# EAGLE design SIPM_readout (EAGLE 9.6.2)
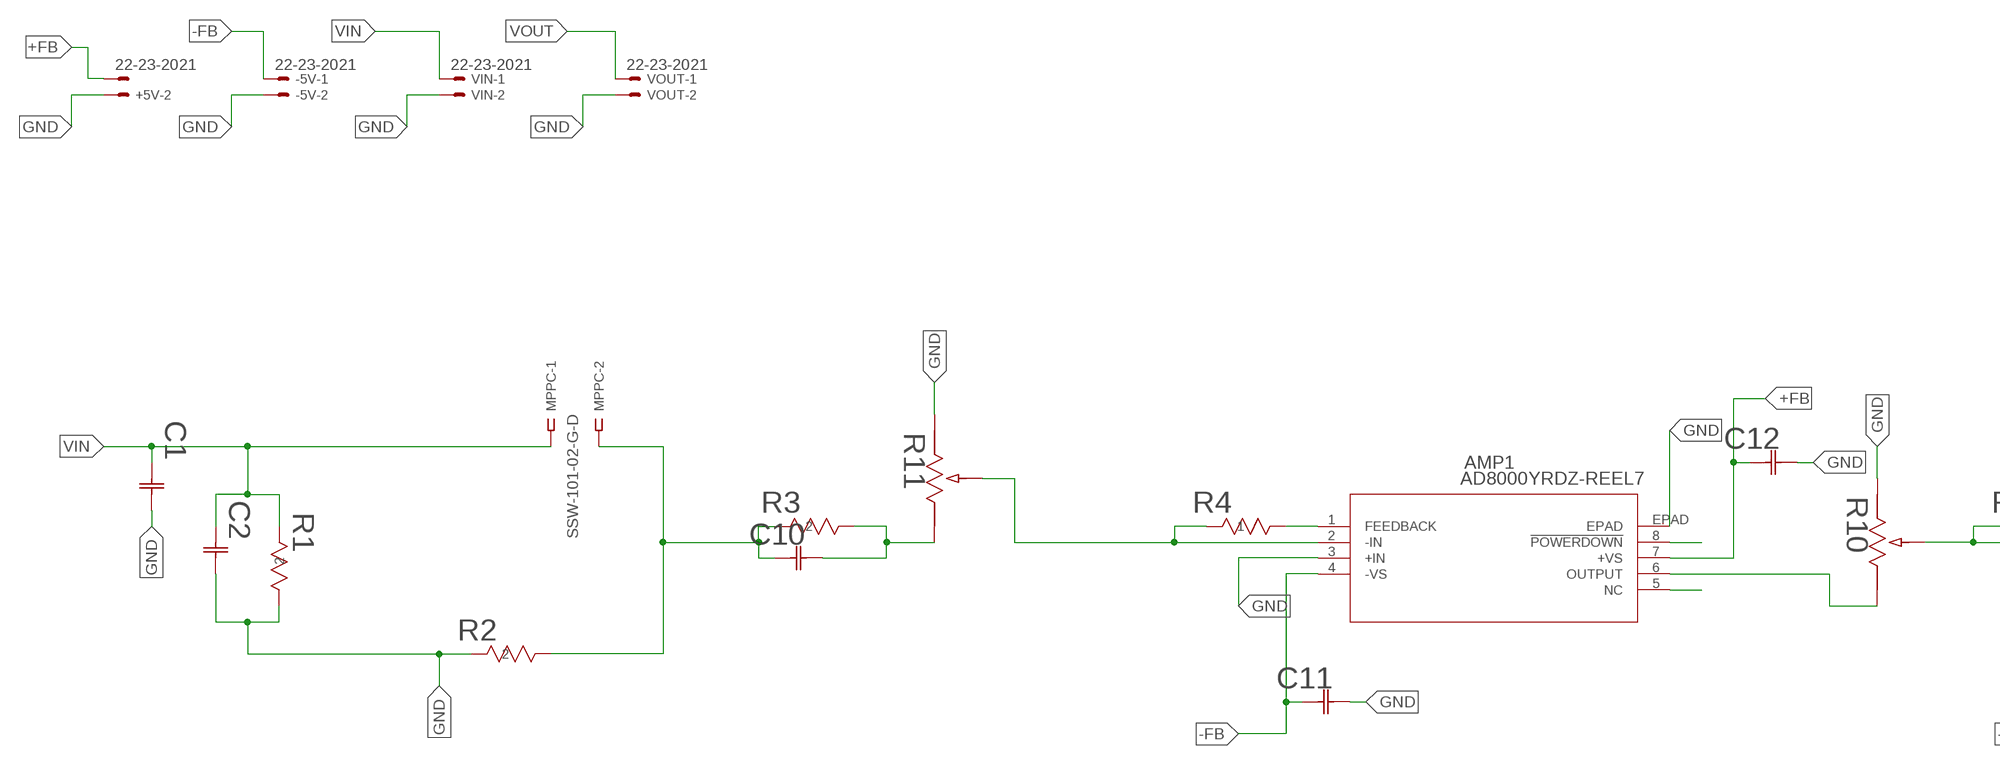
[diagram p0: schematic, sheet 1, part 1 of 2]
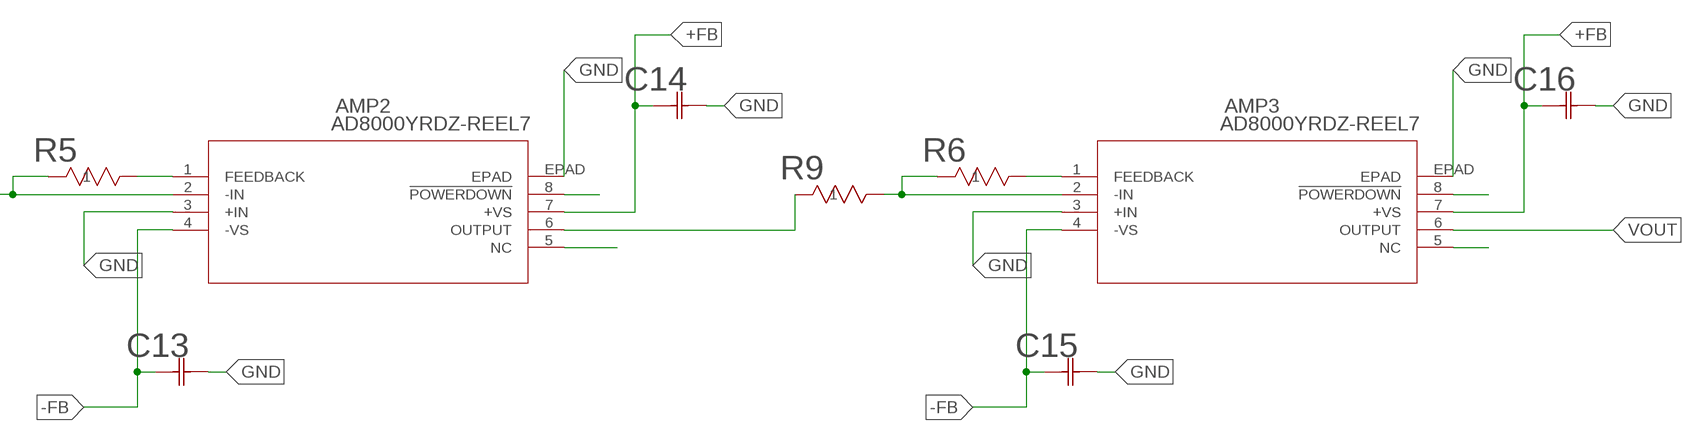
[diagram p1: schematic, sheet 1, part 2 of 2]

## Parts
+5V  22-23-2021  [22-23-2021]
-5V  22-23-2021  [22-23-2021]
AMP1  AD8000YRDZ-REEL7  [RD_8_1_ADI]
AMP2  AD8000YRDZ-REEL7  [RD_8_1_ADI]
AMP3  AD8000YRDZ-REEL7  [RD_8_1_ADI]
C1  C3225X7S2A335M200ABCAP_3225_TDK-M  [CAP_3225_TDK-M]
C2  C3225X7R2A105K200AACAP_3225_TDK-M  [CAP_3225_TDK-M]
C10  CGA3E2C0G1H101J080AA  [CAP_1608_TDK]
C11  CL10B104KB8NNNL  [CAP_CL10_SAM]
C12  CL10B104KB8NNNL  [CAP_CL10_SAM]
C13  CL10B104KB8NNNL  [CAP_CL10_SAM]
C14  CL10B104KB8NNNL  [CAP_CL10_SAM]
C15  CL10B104KB8NNNL  [CAP_CL10_SAM]
C16  CL10B104KB8NNNL  [CAP_CL10_SAM]
MPPC  SSW-101-02-G-D  [SSW-101-02-G-D]
R1  RC0603FR-072ML  [RC0603N_YAG]
R2  RT0603BRD0710RL  [RC0603N_YAG]
R3  RT0603BRD0710RL  [RC0603N_YAG]
R4  ESR03EZPF1001  [RES_R0603_ROM]
R5  ESR03EZPF1001  [RES_R0603_ROM]
R6  ESR03EZPF1001  [RES_R0603_ROM]
R9  ESR03EZPF1001  [RES_R0603_ROM]
R10  3214W-1-103E  [POT_3214W]
R11  3214W-1-103E  [POT_3214W]
VIN  22-23-2021  [22-23-2021]
VOUT  22-23-2021  [22-23-2021]

## Nets
+FB: +5V.1 AMP1.7(+VS) AMP2.7(+VS) AMP3.7(+VS) C12.1 C14.1 C16.1
-FB: -5V.1 AMP1.4(-VS) AMP2.4(-VS) AMP3.4(-VS) C11.1 C13.1 C15.1
GND: +5V.2 -5V.2 AMP1.3(+IN) AMP1.EPAD AMP2.3(+IN) AMP2.EPAD AMP3.3(+IN) AMP3.EPAD C1.2 C2.2 C11.2 C12.2 C13.2 C14.2 C15.2 C16.2 R1.1 R2.2 R10.1 R11.1 VIN.2 VOUT.2
N$1: AMP1.6(OUTPUT) R10.3
N$2: C10.1 MPPC.2 R2.1 R3.2
N$3: C10.2 R3.1 R11.3
N$4: AMP1.2(-IN) R4.1 R11.2
N$5: AMP1.5(NC)
N$6: AMP1.8(!POWERDOWN)
N$7: AMP1.1(FEEDBACK) R4.2
N$9: AMP2.8(!POWERDOWN)
N$10: AMP2.5(NC)
N$11: AMP2.1(FEEDBACK) R5.2
N$12: AMP2.2(-IN) R5.1 R10.2
N$14: AMP3.8(!POWERDOWN)
N$15: AMP3.5(NC)
N$16: AMP3.1(FEEDBACK) R6.2
N$17: AMP3.2(-IN) R6.1 R9.2
N$18: AMP2.6(OUTPUT) R9.1
VIN: C1.1 C2.1 MPPC.1 R1.2 VIN.1
VOUT: AMP3.6(OUTPUT) VOUT.1

## Library data of the parts
+5V -5V VIN VOUT = con-molex:22-23-2021: .100" (2.54mm) Center Header - 2 Pin; MF: MOLEX; MPN: 22-23-2021; OC_FARNELL: 1462926; OC_NEWARK: 25C3832
AMP1-AMP3 = SiPM_AD8000:AD8000YRDZ-REEL7; BUILT_BY: EMA_Jessica; COPYRIGHT: Copyright (C) 2018 Accelerated Designs. All rights reserved; MANUFACTURER_PART_NUMBER: AD8000YRDZ-REEL7; SOURCELIBRARY: Analog_2019-03-01; VENDOR: Analog Devices Inc
C1 = SiPM_3.3uF:C3225X7S2A335M200AB; BUILT_BY: EMA_UL_Team; MANUFACTURER_PART_NUMBER: C3225X7S2A335M200AB; SOURCELIBRARY: TDK_2015_05_22; VENDOR: TDK
C2 = SiPM_1uF:C3225X7R2A105K200AA; BUILT_BY: EMA_UL_Team; MANUFACTURER_PART_NUMBER: C3225X7R2A105K200AA; SOURCELIBRARY: TDK_2015_05_22; VENDOR: TDK
C10 = SiPM_100p:CGA3E2C0G1H101J080AA; BUILT_BY: EMA_UL_Team; MANUFACTURER_PART_NUMBER: CGA3E2C0G1H101J080AA; SOURCELIBRARY: TDK_2015_05_22; VENDOR: TDK
C11-C16 = SiPM_01u:CL10B104KB8NNNL; BUILT_BY: EMA_Rocco; COPYRIGHT: Copyright (C) 2018 Accelerated Designs. All rights reserved; MANUFACTURER_PART_NUMBER: CL10B104KB8NNNL; SOURCELIBRARY: Samsung_2019-08-29; VENDOR: Samsung
MPPC = con-samtec:SSW-101-02-G: THROUGH-HOLE .025" SQ POST SOCKET Source: Samtec SSW.pdf; MF: Samtec Inc.; MPN: SSW-101-02-G-D; OC_FARNELL: unknown; OC_NEWARK: 82P1456
R1 = SiPM_R6:RC0603FR-072ML; BUILT_BY: EMA_UL_Team; MANUFACTURER_PART_NUMBER: RC0603FR-072ML; SOURCELIBRARY: Yageo_2008-01-01_ChipRes1a; VENDOR: Yageo
R2 R3 = SiPM_R7:RT0603BRD0710RL; BUILT_BY: EMA_UL_Team; MANUFACTURER_PART_NUMBER: RT0603BRD0710RL; SOURCELIBRARY: Yageo_2008-01-01_ChipRes2b; VENDOR: Yageo
R4-R6 R9 = SiPM_R11:ESR03EZPF1001; BUILT_BY: EMA_UL_Team; MANUFACTURER_PART_NUMBER: ESR03EZPF1001; SOURCELIBRARY: Rohm_2015_05_27; VENDOR: ROHM Semiconductor
R10 R11 = SiPM_trim:3214W-1-103E; BUILT_BY: EMA_UL_Team; MANUFACTURER_PART_NUMBER: 3214W-1-103E; SOURCELIBRARY: Bourns_2012-08-08; VENDOR: Bourns Electronics

## Board
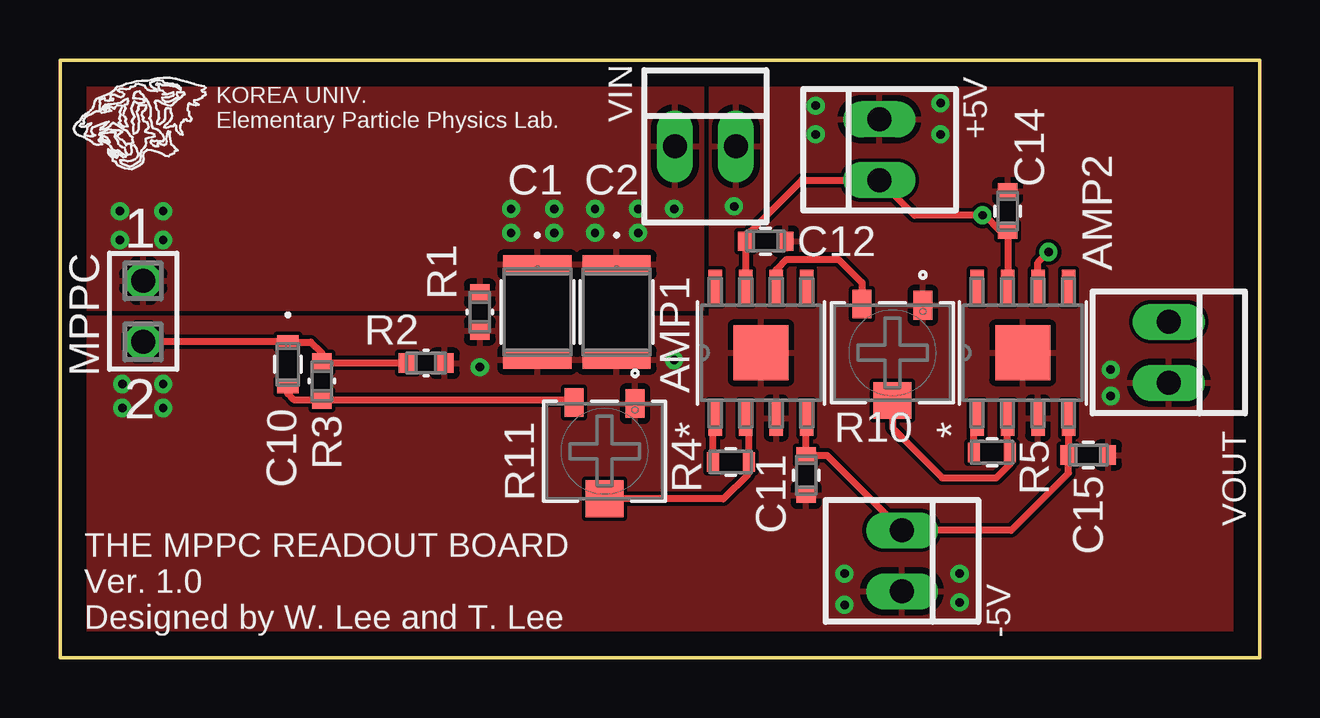
[diagram p2: board, top side]
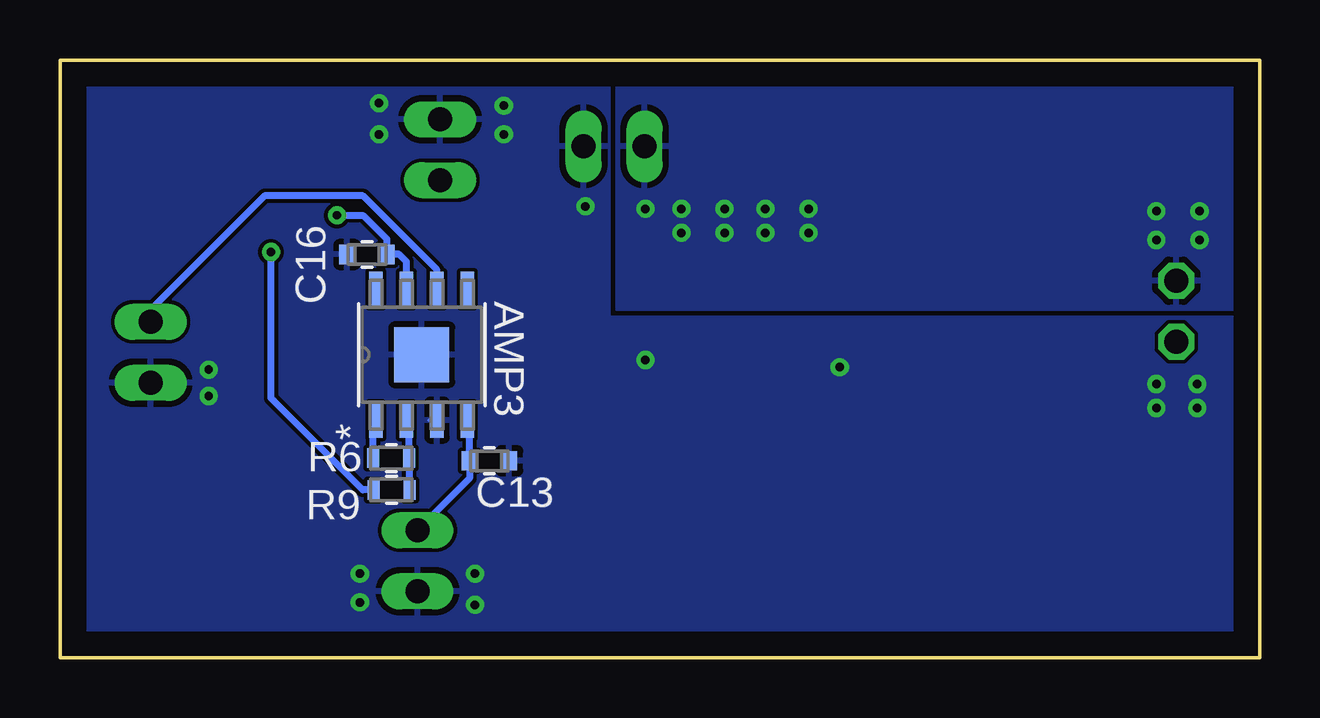
[diagram p3: board, bottom side, seen from below]

Size 50 x 24.9 mm. Coordinates in mm from the lower left corner, seen from the top.
Outline: 50,0 0,0 0,24.9 50,24.9 50,0
Copper layers (1*16): Top 0.035mm / dielectric 1.5mm / Bottom 0.035mm
Design rules "default": minimum track width 6mil, minimum drill 0.35mm, track to track 6mil, track to pad 6mil, pad to pad 6mil, via to via 6mil, smd to smd 6mil, copper to edge 40mil, drill to drill 6mil, minimum pad ring 10mil, minimum via ring 8mil, stop-mask expansion 4mil, vias tented up to drill 0mil, thermal gap 10mil

### Footprints (pad centres in the part's own frame; a part is rotated, then mirrored left to right if it is on the bottom)
22-23-2021 = drill 1 long: 1 -1.27,0; 2 1.27,0
RD_8_1_ADI = smd 1.46 x 0.559: 1 -2.724,1.905; 2 -2.724,0.635; 3 -2.724,-0.635; 4 -2.724,-1.905; 5 2.724,-1.905; 6 2.724,-0.635; 7 2.724,0.635; 8 2.724,1.905 | smd 2.286 x 2.286: EPAD 0,0
CAP_3225_TDK-M = smd 0.762 x 2.845: 1 -1.981,0; 2 1.981,0
CAP_1608_TDK = smd 0.559 x 0.889: 1 -0.927,0; 2 0.927,0
CAP_CL10_SAM = smd 0.656 x 0.8: 1 -0.828,0; 2 0.828,0
SSW-101-02-G-D = drill 1 pad 1.5 octagon: 1 0,-1.27; 2 0,1.27
RC0603N_YAG = smd 0.762 x 0.813: 1 -0.775,0; 2 0.775,0
RES_R0603_ROM = smd 0.5 x 0.813: 1 -0.75,0; 2 0.75,0
POT_3214W = smd 0.787 x 1.194: 1 -1.27,-1.981; 3 1.27,-2.032 | smd 1.575 x 1.524: 2 0,1.981

### Placement (x,y rotation side)
+5V  34.16,21.16 90 top
-5V  35.1,4.03 270 top
AMP1  29.22,12.7 90 top
AMP2  40.13,12.7 90 top
AMP3  34.92,12.62 90 bottom
C1  19.9,14.4 270 top
C2  23.2,14.4 270 top
C10  9.5,12.22 270 top
C11  31.1,7.6 270 top
C12  29.41,17.35 0 top
C13  32.1,8.2 0 bottom
C14  39.5,18.6 90 top
C15  42.86,8.44 0 top
C16  37.2,16.8 180 bottom
MPPC  3.47,14.43 180 top
R1  17.5,14.4 90 top
R2  15.26,12.27 0 top
R3  10.91,11.52 90 top
R4  27.96,8.15 180 top
R5  38.85,8.55 180 top
R6  36.19,8.31 180 bottom
R9  36.18,6.99 0 bottom
R10  34.7,12.7 180 top
R11  22.7,8.6 180 top
VIN  26.9,21.3 0 top
VOUT  46.22,12.72 270 top

### Tracks (layer width: path | path; a pad name or v marks a point on that pad's centre or on a via)
+FB  (via drill 0.35)
  Top 0.152: AMP1.7 28.6,15.44 | C14.1
  Top 0.3: AMP1.7 C12.1 28.8,17.57 28.8,17.77 30.92,19.89 +5V.1 35.62,18.43 v38.45,18.43 38.55,18.43 39.21,17.77 C14.1 AMP2.7
  Top 0.5: AMP1.7 28.57,15.44
  Bottom 0.3: AMP3.7 35.55,16.5 35.86,16.8 C16.1 36.37,17.43 37.37,18.43 v38.45,18.43
-FB
  Top 0.3: C11.1 31.1,9.95 AMP1.4 | AMP2.4 C15.1 | C15.1 | C11.1 31.3,8.43 | C11.1 31.97,8.43 -5V.1 39.65,5.3 42.03,7.68 C15.1
  Bottom 0.152: 33.02,8.29 C13.1
  Bottom 0.3: AMP3.4 32.93,9.81 C13.1 32.93,7.47 -5V.1
GND  (via drill 0.35)
  Bottom 0.152: 34.62,9.9 AMP3.3
  other vias: 2.6,11.4 4.3,11.4 2.6,10.4 4.3,10.4 25.6,12.4 17.5,12.1 43.8,12 43.8,10.9 37.5,3.5 37.5,2.3 32.7,3.5 32.7,2.2 31.5,23 31.5,21.8 36.7,23.1 36.7,21.8 28.1,18.8
  pour Top: 50,0.7 1.1,0.7 1.1,14.2 27.1,14.2 27.1,24.8 50,24.8
  pour Bottom: 0,0.7 49.7,0.7 49.7,24.89 27.1,24.9 27.1,14.2 0,14.2
N$1
  Top 0.3: AMP1.6 29.86,16.16 30.29,16.6 32.45,16.6 33.43,15.62 R10.3
N$2
  Top 0.152: 14.45,12.5 14.52,12.42
  Top 0.3: 14.75,12.2 14.52,12.42 14.52,12.31 R2.1 14.46,12.3 R3.2 10.91,12.7 10.46,13.15 C10.1 9.49,13.16 MPPC.2
N$3
  Top 0.152: 10.84,10.67 R3.1
  Top 0.3: C10.2 9.5,10.99 9.75,10.75 R3.1 21.32,10.75 R11.3
  Top 0.5: R3.1 10.87,10.71
N$4
  Top 0.3: R11.2 27.65,6.61 28.67,7.63 28.67,8.11 R4.1 28.71,9.85 AMP1.2
  Top 0.5: R4.1
N$7
  Top 0.3: R4.2 27.21,9.87 AMP1.1
N$11
  Top 0.152: AMP2.1 38.1,9.85
  Top 0.3: R5.2 38.1,9.85
N$12
  Top 0.152: 39.59,8.54 R5.1 | 39.59,8.56 39.5,8.67
  Top 0.3: R5.1 39.59,8.56 39.59,8.06 39.02,7.49 36.78,7.49 34.7,9.57 R10.2 | R5.1 39.5,8.66 39.5,8.67 AMP2.2
N$16
  Bottom 0.3: R6.2 36.94,9.78 AMP3.1
N$17
  Bottom 0.152: 35.52,8.39 R6.1 35.49,8.26
  Bottom 0.3: AMP3.2 35.44,9.78 R6.1 R9.2
N$18  (via drill 0.35)
  Top 0.3: AMP2.6 40.77,16.47 v41.2,16.9
  Bottom 0.3: R9.1 37.38,6.99 41.2,10.81 v41.2,16.9
VIN  (via drill 0.35, 0.35 pad 0.55)
  other vias: 4.3,17.4 2.5,17.4 2.5,18.6 4.3,18.6 24.1,17.7 22.3,17.7 20.6,17.7 18.8,17.7 18.8,18.7 20.6,18.7 22.3,18.7 24.1,18.7 25.6,18.7
  pour Top: 26.8,24.89 0,24.89 0,14.5 26.8,14.5
  pour Bottom: 0,14.5 26.8,14.5 26.8,24.9 0,24.9
VOUT
  Bottom 0.3: AMP3.6 34.28,16.16 37.37,19.24 41.47,19.24 46.22,14.49 VOUT.1

### Text on the board
tNames: KOREA UNIV. / Elementary Particle Physics Lab. | THE MPPC READOUT BOARD / Ver. 1.0 / Designed by W. Lee and T. Lee